# Altium schematic sheet sheet_V1.SchDoc
size A2
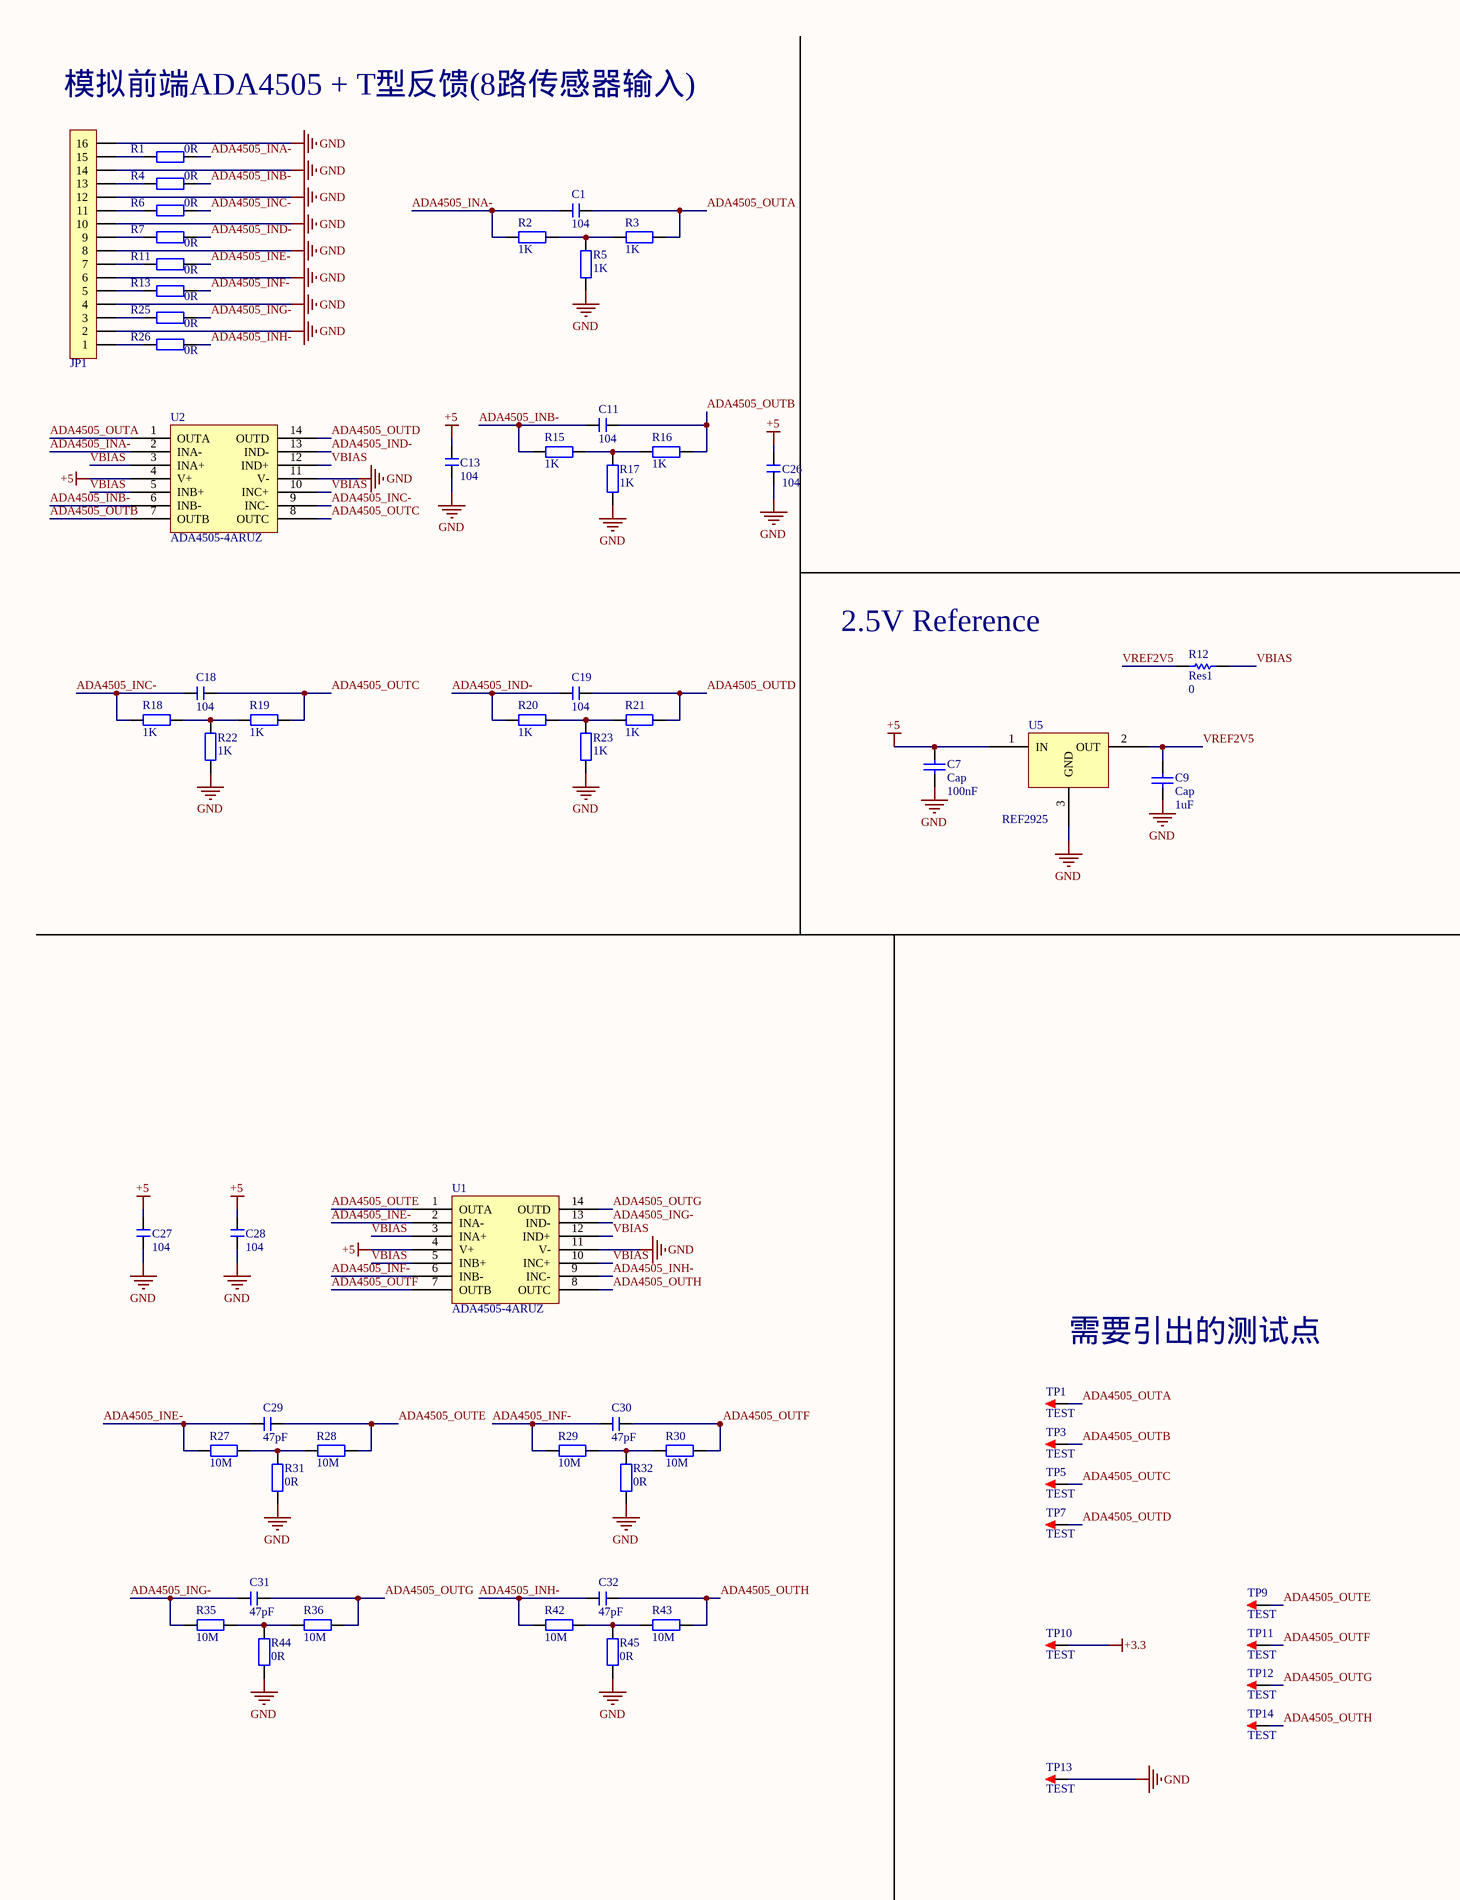
[diagram p0: sheet_V1.SchDoc, left]
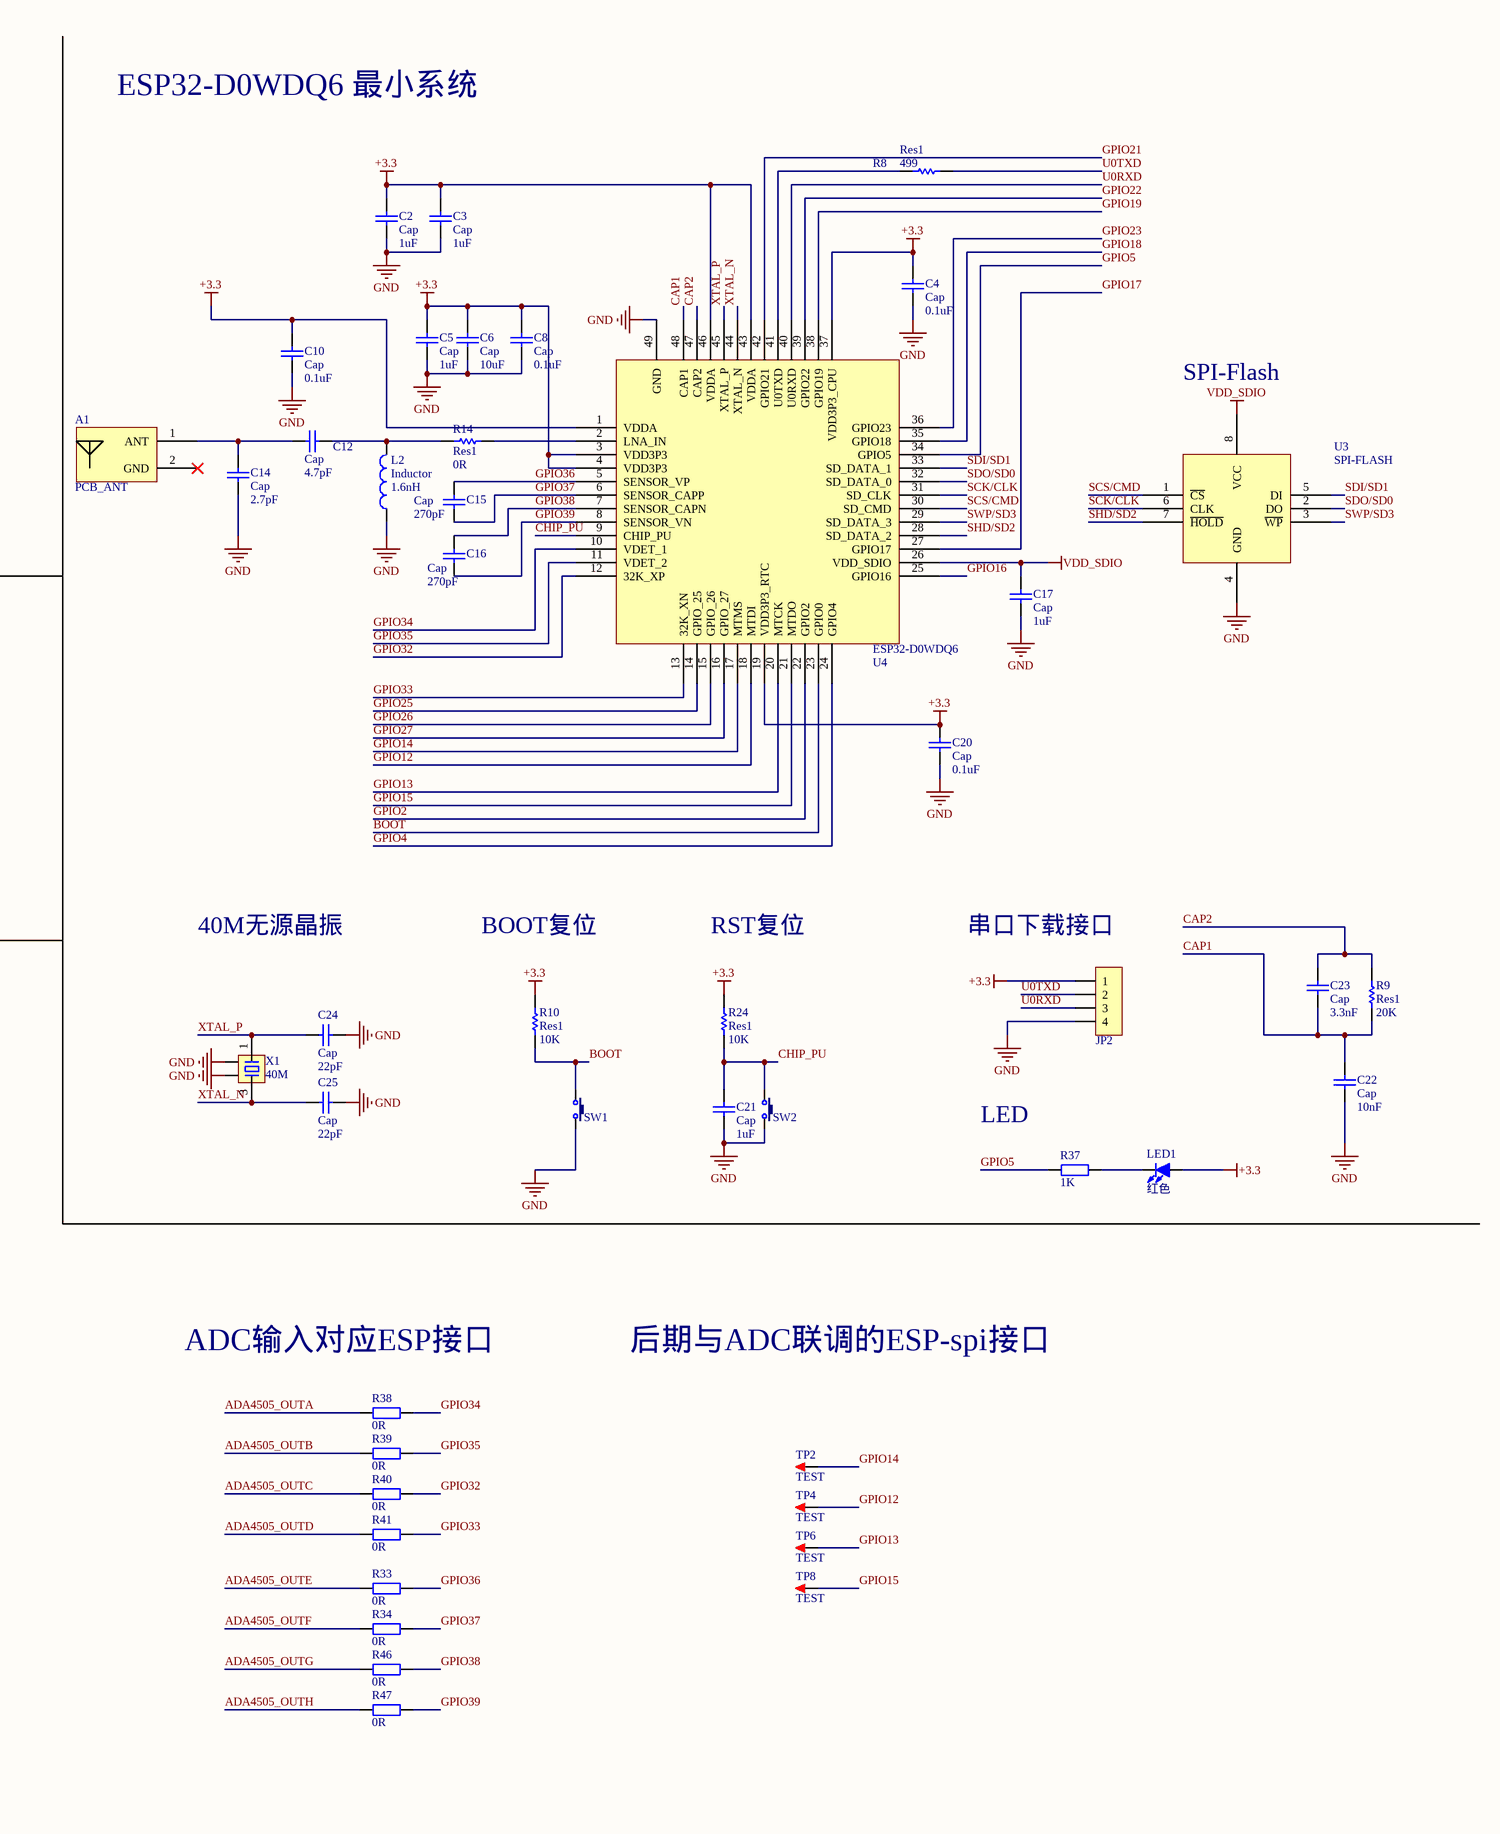
[diagram p1: sheet_V1.SchDoc, right]

## Parts
A1  PCB_ANT  [PCB_ANT]
C1  104  [C 0402_L]
C2  Cap  value 1uF  [C 0402_L]
C3  Cap  value 1uF  [C 0402_L]
C4  Cap  value 0.1uF  [C 0402_L]
C5  Cap  value 1uF  [C 0402_L]
C6  Cap  value 10uF  [C 0402_L]
C7  Cap  value 100nF  [C 0402_L]
C8  Cap  value 0.1uF  [C 0402_L]
C9  Cap  value 1uF  [C 0402_L]
C10  Cap  value 0.1uF  [C 0402_L]
C11  104  [C 0402_L]
C12  Cap  value 4.7pF  [C 0402_L]
C13  104  [C 0402_L]
C14  Cap  value 2.7pF  [C 0402_L]
C15  Cap  value 270pF  [C 0402_L]
C16  Cap  value 270pF  [C 0402_L]
C17  Cap  value 1uF  [C 0402_L]
C18  104  [C 0402_L]
C19  104  [C 0402_L]
C20  Cap  value 0.1uF  [C 0402_L]
C21  Cap  value 1uF  [C 0402_L]
C22  Cap  value 10nF  [C 0402_L]
C23  Cap  value 3.3nF  [C 0402_L]
C24  Cap  value 22pF  [C 0402_L]
C25  Cap  value 22pF  [C 0402_L]
C26  104  [C 0402_L]
C27  104  [C 0402_L]
C28  104  [C 0402_L]
C29  47pF  [C 0402_L]
C30  47pF  [C 0402_L]
C31  47pF  [C 0402_L]
C32  47pF  [C 0402_L]
JP1  HDR-1X16  [FPC0.5 2H-WS-16P]  (value not drawn)
JP2  HDR-1X4  [2.54_pad_4]  (value not drawn)
L2  Inductor  value 1.6nH  [L 0402]
LED1  红色  [LED 0603R]
R1  0R  [R 0402_L]
R2  1K  [R 0805_L]
R3  1K  [R 0805_L]
R4  0R  [R 0402_L]
R5  1K  [R 0805_L]
R6  0R  [R 0402_L]
R7  0R  [R 0402_L]
R8  Res1  value 499  [R 0402_L]
R9  Res1  value 20K  [R 0402_L]
R10  Res1  value 10K  [R 0402_L]
R11  0R  [R 0402_L]
R12  Res1  value 0  [R 0402_L]
R13  0R  [R 0402_L]
R14  Res1  value 0R  [R 0402_L]
R15  1K  [R 0805_L]
R16  1K  [R 0805_L]
R17  1K  [R 0805_L]
R18  1K  [R 0805_L]
R19  1K  [R 0805_L]
R20  1K  [R 0805_L]
R21  1K  [R 0805_L]
R22  1K  [R 0805_L]
R23  1K  [R 0805_L]
R24  Res1  value 10K  [R 0402_L]
R25  0R  [R 0402_L]
R26  0R  [R 0402_L]
R27  10M  [R 0805_L]
R28  10M  [R 0805_L]
R29  10M  [R 0805_L]
R30  10M  [R 0805_L]
R31  0R  [R 0805_L]
R32  0R  [R 0805_L]
R33  0R  [R 0402_L]
R34  0R  [R 0402_L]
R35  10M  [R 0805_L]
R36  10M  [R 0805_L]
R37  1K  [R 0402_L]
R38  0R  [R 0402_L]
R39  0R  [R 0402_L]
R40  0R  [R 0402_L]
R41  0R  [R 0402_L]
R42  10M  [R 0805_L]
R43  10M  [R 0805_L]
R44  0R  [R 0805_L]
R45  0R  [R 0805_L]
R46  0R  [R 0402_L]
R47  0R  [R 0402_L]
SW1  3x6x5  [KEY-little]  (value not drawn)
SW2  3x6x5  [KEY-little]  (value not drawn)
TP1  TEST  [TEST 0.8]
TP2  TEST  [TEST 0.8]
TP3  TEST  [TEST 0.8]
TP4  TEST  [TEST 0.8]
TP5  TEST  [TEST 0.8]
TP6  TEST  [TEST 0.8]
TP7  TEST  [TEST 0.8]
TP8  TEST  [TEST 0.8]
TP9  TEST  [TEST 0.8]
TP10  TEST  [TEST 0.8]
TP11  TEST  [TEST 0.8]
TP12  TEST  [TEST 0.8]
TP13  TEST  [TEST 0.8]
TP14  TEST  [TEST 0.8]
U1  ADA4505-4ARUZ  [ADA4505-4ARUZ]
U2  ADA4505-4ARUZ  [ADA4505-4ARUZ]
U3  SPI-FLASH  [SPI-Flash]
U4  ESP32-D0WDQ6  [ESP32D0WDQ6]
U5  REF2925  [REF2925AIDBZR]
X1  40M  [晶振3225]

## Nets
+3.3: C2.2 C3.2 C4.2 C5.2 C6.2 C8.2 C10.2 C20.2 JP2.1 LED1.1(A) R10.2 R24.2 TP10.1 U4.1(VDDA) U4.3(VDD3P3) U4.4(VDD3P3) U4.19(VDD3P3_RTC) U4.37(VDD3P3_CPU) U4.43(VDDA) U4.46(VDDA)
+5: C7.2 C13.2 C26.2 C27.2 C28.2 U1.4(V+) U2.4(V+) U5.1(IN)
GND: C2.1 C3.1 C4.1 C5.1 C6.1 C7.1 C8.1 C9.1 C10.1 C13.1 C14.1 C17.1 C20.1 C21.1 C22.1 C24.2 C25.2 C26.1 C27.1 C28.1 JP1.2 JP1.4 JP1.6 JP1.8 JP1.10 JP1.12 JP1.14 JP1.16 JP2.4 L2.1 R5.2 R17.2 R22.2 R23.2 R31.2 R32.2 R44.2 R45.2 SW1.2 SW2.2 TP13.1 U1.11(V-) U2.11(V-) U3.4(GND) U4.49(GND) U5.3(GND) X1.2 X1.4
VDD_SDIO: C17.2 U3.8(VCC) U4.26(VDD_SDIO)
ADA4505_INA-: C1.1 R1.2 R2.2 U2.2(INA-)
ADA4505_INB-: C11.1 R4.2 R15.2 U2.6(INB-)
ADA4505_INC-: C18.1 R6.2 R18.2 U2.9(INC-)
ADA4505_IND-: C19.1 R7.2 R20.2 U2.13(IND-)
ADA4505_INE-: C29.1 R11.2 R27.2 U1.2(INA-)
ADA4505_INF-: C30.1 R13.2 R29.2 U1.6(INB-)
ADA4505_ING-: C31.1 R25.2 R35.2 U1.13(IND-)
ADA4505_INH-: C32.1 R26.2 R42.2 U1.9(INC-)
ADA4505_OUTA: C1.2 R3.1 R38.1 TP1.1 U2.1(OUTA)
ADA4505_OUTB: C11.2 R16.1 R39.1 TP3.1 U2.7(OUTB)
ADA4505_OUTC: C18.2 R19.1 R40.1 TP5.1 U2.8(OUTC)
ADA4505_OUTD: C19.2 R21.1 R41.1 TP7.1 U2.14(OUTD)
ADA4505_OUTE: C29.2 R28.1 R33.1 TP9.1 U1.1(OUTA)
ADA4505_OUTF: C30.2 R30.1 R34.1 TP11.1 U1.7(OUTB)
ADA4505_OUTG: C31.2 R36.1 R46.1 TP12.1 U1.14(OUTD)
ADA4505_OUTH: C32.2 R43.1 R47.1 TP14.1 U1.8(OUTC)
BOOT: R10.1 SW1.1 U4.23(GPIO0)
CAP1: C22.2 C23.1 R9.1 U4.48(CAP1)
CAP2: C23.2 R9.2 U4.47(CAP2)
CHIP_PU: C21.2 R24.1 SW2.1 U4.9(CHIP_PU)
GPIO2: U4.22(GPIO2)
GPIO4: U4.24(GPIO4)
GPIO5: R37.1 U4.34(GPIO5)
GPIO12: TP4.1 U4.18(MTDI)
GPIO13: TP6.1 U4.20(MTCK)
GPIO14: TP2.1 U4.17(MTMS)
GPIO15: TP8.1 U4.21(MTDO)
GPIO16: U4.25(GPIO16)
GPIO17: U4.27(GPIO17)
GPIO18: U4.35(GPIO18)
GPIO19: U4.38(GPIO19)
GPIO21: U4.42(GPIO21)
GPIO22: U4.39(GPIO22)
GPIO23: U4.36(GPIO23)
GPIO25: U4.14(GPIO_25)
GPIO26: U4.15(GPIO_26)
GPIO27: U4.16(GPIO_27)
GPIO32: R40.2 U4.12(32K_XP)
GPIO33: R41.2 U4.13(32K_XN)
GPIO34: R38.2 U4.10(VDET_1)
GPIO35: R39.2 U4.11(VDET_2)
GPIO36: C15.2 R33.2 U4.5(SENSOR_VP)
GPIO37: C15.1 R34.2 U4.6(SENSOR_CAPP)
GPIO38: C16.2 R46.2 U4.7(SENSOR_CAPN)
GPIO39: C16.1 R47.2 U4.8(SENSOR_VN)
SCK/CLK: U3.6(CLK) U4.31(SD_CLK)
SCS/CMD: U3.1(~{CS}) U4.30(SD_CMD)
SDI/SD1: U3.5(DI) U4.33(SD_DATA_1)
SDO/SD0: U3.2(DO) U4.32(SD_DATA_0)
SHD/SD2: U3.7(~{HOLD}) U4.28(SD_DATA_2)
SWP/SD3: U3.3(~{WP}) U4.29(SD_DATA_3)
U0RXD: JP2.3 U4.40(U0RXD)
U0TXD: JP2.2 R8.2
VBIAS: R12.2 U1.3(INA+) U1.5(INB+) U1.10(INC+) U1.12(IND+) U2.3(INA+) U2.5(INB+) U2.10(INC+) U2.12(IND+)
VREF2V5: C9.2 R12.1 U5.2(OUT)
XTAL_N: C25.1 U4.44(XTAL_N) X1.3
XTAL_P: C24.1 U4.45(XTAL_P) X1.1
NetA1_1: A1.1(ANT) C12.1 C14.2
NetC12_2: C12.2 L2.2 R14.1
NetJP1_1: JP1.1 R26.1
NetJP1_3: JP1.3 R25.1
NetJP1_5: JP1.5 R13.1
NetJP1_7: JP1.7 R11.1
NetJP1_9: JP1.9 R7.1
NetJP1_11: JP1.11 R6.1
NetJP1_13: JP1.13 R4.1
NetJP1_15: JP1.15 R1.1
NetLED1_2: LED1.2(K) R37.2
NetR2_1: R2.1 R3.2 R5.1
NetR8_1: R8.1 U4.41(U0TXD)
NetR14_2: R14.2 U4.2(LNA_IN)
NetR15_1: R15.1 R16.2 R17.1
NetR18_1: R18.1 R19.2 R22.1
NetR20_1: R20.1 R21.2 R23.1
NetR27_1: R27.1 R28.2 R31.1
NetR29_1: R29.1 R30.2 R32.1
NetR35_1: R35.1 R36.2 R44.1
NetR42_1: R42.1 R43.2 R45.1

Not connected (* = marked no-connect by the designer): A1 2(GND)*

## Notes on the sheet
- 模拟前端ADA4505 + T型反馈(8路传感器输入)
- ESP32-D0WDQ6 最小系统
- SPI-Flash
- 2.5V Reference
- 40M无源晶振
- BOOT复位
- RST复位
- 串口下载接口
- LED
- 需要引出的测试点
- ADC输入对应ESP接口
- 后期与ADC联调的ESP-spi接口

## Library data of the parts
A1 = PCB_ANT: 2.4G-esp32
C1 C11 C13 C18 C19 C26-C32 = C: 无极性贴片电容; 版权归属: 源创客; BOM名称: 无极性贴片电容; 学习资源: www.ooocke.com
C2-C10 C12 C14-C17 C20-C25 = Cap: Capacitor; Published: 8-Jun-2000; LatestRevisionDate: 17-Jul-2002; LatestRevisionNote: Re-released for DXP Platform.; PackageReference: RAD-0.3; Publisher: Altium Limited; PackageDescription: Radial Cap, Thru-Hole; 2 Leads; 0.3 in Pin Spacing
JP1 = Header 16: 16P接插件; 版权归属: 源创客; BOM名称: 16P接插件; 学习资源: www.ooocke.com
JP2 = Header 4: 4P接插件; 版权归属: 源创客; BOM名称: 4P接插件; 学习资源: www.ooocke.com
L2 = Inductor: Code_IEC: 1005; Published: 8-Jun-2000; LatestRevisionDate: 29-May-2009; LatestRevisionNote: IPC-7351 Footprint Added.; PackageReference: 0402-A; Publisher: Altium Limited; PackageDescription: Chip Inductor; Code_JEITA: 0402
LED1 = LED-SMD: 贴片LED; 版权归属: 源创客; BOM名称: 贴片LED; 学习资源: www.ooocke.com
R1-R7 R11 R13 R15-R23 R25-R47 = R: 贴片电阻; 版权归属: 源创客; BOM名称: 贴片电阻; 学习资源: www.ooocke.com
R8-R10 R12 R14 R24 = Res1: Resistor; Published: 8-Jun-2000; LatestRevisionDate: 17-Jul-2002; LatestRevisionNote: Re-released for DXP Platform.; PackageReference: AXIAL-0.3; Publisher: Altium Limited; PackageDescription: Axial Device, Thru-Hole; 2 Leads; 0.3 in Pin Spacing
SW1 SW2 = TSW 3x6: 3x6轻触开关; 版权归属: 源创客; BOM名称: 3x6轻触开关; 学习资源: www.ooocke.com
TP1-TP14 = TEST: 测试点; 版权归属: 源创客; BOM名称: 测试点; 学习资源: www.ooocke.com
U5 = REF2925: 2.5V reference
X1 = XTAL-4P: 4脚无源晶振; 版权归属: 源创客; BOM名称: 4脚无源晶振; 学习资源: www.ooocke.com